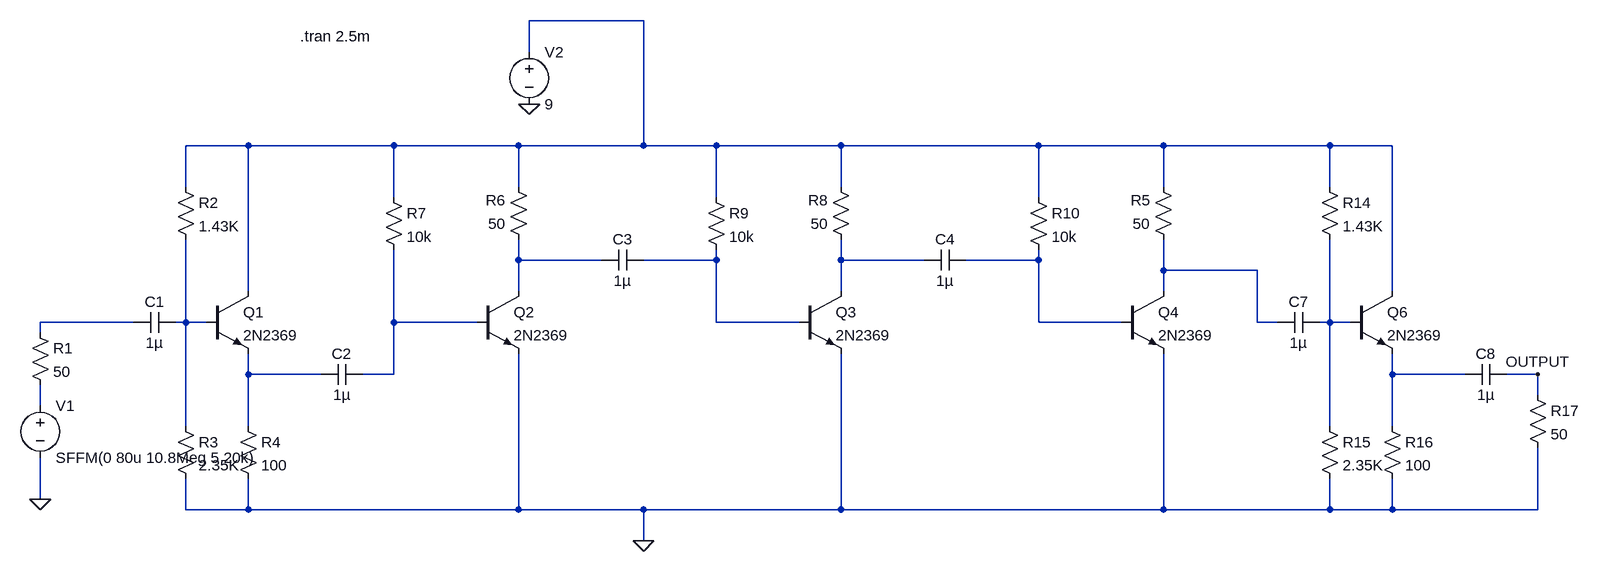
[diagram p0: schematic Multistage_Amplifier.asc]
Multistage_Amplifier.asc, the LTspice schematic file:
Version 4
SHEET 1 3060 680
WIRE 992 -192 816 -192
WIRE 816 -144 816 -192
WIRE 384 0 288 0
WIRE 608 0 384 0
WIRE 800 0 608 0
WIRE 992 0 992 -192
WIRE 992 0 800 0
WIRE 1104 0 992 0
WIRE 1296 0 1104 0
WIRE 1600 0 1296 0
WIRE 1792 0 1600 0
WIRE 2048 0 1792 0
WIRE 2144 0 2048 0
WIRE 288 64 288 0
WIRE 800 64 800 0
WIRE 1296 64 1296 0
WIRE 1792 64 1792 0
WIRE 2048 64 2048 0
WIRE 608 80 608 0
WIRE 1104 80 1104 0
WIRE 1600 80 1600 0
WIRE 800 176 800 144
WIRE 928 176 800 176
WIRE 1104 176 1104 160
WIRE 1104 176 992 176
WIRE 1296 176 1296 144
WIRE 1424 176 1296 176
WIRE 1600 176 1600 160
WIRE 1600 176 1488 176
WIRE 1792 192 1792 144
WIRE 1936 192 1792 192
WIRE 384 224 384 0
WIRE 800 224 800 176
WIRE 1296 224 1296 176
WIRE 1792 224 1792 192
WIRE 2144 224 2144 0
WIRE 208 272 64 272
WIRE 288 272 288 144
WIRE 288 272 272 272
WIRE 320 272 288 272
WIRE 608 272 608 160
WIRE 736 272 608 272
WIRE 1104 272 1104 176
WIRE 1232 272 1104 272
WIRE 1600 272 1600 176
WIRE 1728 272 1600 272
WIRE 1936 272 1936 192
WIRE 1968 272 1936 272
WIRE 2048 272 2048 144
WIRE 2048 272 2032 272
WIRE 2080 272 2048 272
WIRE 64 288 64 272
WIRE 384 352 384 320
WIRE 496 352 384 352
WIRE 608 352 608 272
WIRE 608 352 560 352
WIRE 2144 352 2144 320
WIRE 2256 352 2144 352
WIRE 2368 352 2320 352
WIRE 2368 384 2368 352
WIRE 64 400 64 368
WIRE 288 432 288 272
WIRE 384 432 384 352
WIRE 2048 432 2048 272
WIRE 2144 432 2144 352
WIRE 64 544 64 480
WIRE 288 560 288 512
WIRE 384 560 384 512
WIRE 384 560 288 560
WIRE 800 560 800 320
WIRE 800 560 384 560
WIRE 992 560 800 560
WIRE 1296 560 1296 320
WIRE 1296 560 992 560
WIRE 1792 560 1792 320
WIRE 1792 560 1296 560
WIRE 2048 560 2048 512
WIRE 2048 560 1792 560
WIRE 2144 560 2144 512
WIRE 2144 560 2048 560
WIRE 2368 560 2368 464
WIRE 2368 560 2144 560
WIRE 992 608 992 560
FLAG 64 544 0
FLAG 992 608 0
FLAG 816 -64 0
FLAG 2368 352 OUTPUT
SYMBOL npn 320 224 R0
SYMATTR InstName Q1
SYMATTR Value 2N2369
SYMBOL npn 736 224 R0
SYMATTR InstName Q2
SYMATTR Value 2N2369
SYMBOL cap 272 256 R90
WINDOW 0 0 32 VBottom 2
WINDOW 3 32 32 VTop 2
SYMATTR InstName C1
SYMATTR Value 1µ
SYMBOL res 48 272 R0
SYMATTR InstName R1
SYMATTR Value 50
SYMBOL voltage 64 384 R0
SYMATTR InstName V1
SYMATTR Value SFFM(0 80u 10.8Meg 5 20k)
SYMBOL voltage 816 -160 R0
SYMATTR InstName V2
SYMATTR Value 9
SYMATTR SpiceLine Rser=0
SYMBOL res 272 48 R0
SYMATTR InstName R2
SYMATTR Value 1.43K
SYMBOL res 272 416 R0
SYMATTR InstName R3
SYMATTR Value 2.35K
SYMBOL res 368 416 R0
SYMATTR InstName R4
SYMATTR Value 100
SYMBOL cap 560 336 R90
WINDOW 0 0 32 VBottom 2
WINDOW 3 32 32 VTop 2
SYMATTR InstName C2
SYMATTR Value 1µ
SYMBOL cap 992 160 R90
WINDOW 0 0 32 VBottom 2
WINDOW 3 32 32 VTop 2
SYMATTR InstName C3
SYMATTR Value 1µ
SYMBOL res 816 160 R180
WINDOW 0 36 76 Left 2
WINDOW 3 36 40 Left 2
SYMATTR InstName R6
SYMATTR Value 50
SYMBOL res 592 64 R0
SYMATTR InstName R7
SYMATTR Value 10k
SYMBOL npn 1232 224 R0
SYMATTR InstName Q3
SYMATTR Value 2N2369
SYMBOL res 1312 160 R180
WINDOW 0 36 76 Left 2
WINDOW 3 36 40 Left 2
SYMATTR InstName R8
SYMATTR Value 50
SYMBOL res 1088 64 R0
SYMATTR InstName R9
SYMATTR Value 10k
SYMBOL cap 1488 160 R90
WINDOW 0 0 32 VBottom 2
WINDOW 3 32 32 VTop 2
SYMATTR InstName C4
SYMATTR Value 1µ
SYMBOL npn 1728 224 R0
SYMATTR InstName Q4
SYMATTR Value 2N2369
SYMBOL res 1808 160 R180
WINDOW 0 36 76 Left 2
WINDOW 3 36 40 Left 2
SYMATTR InstName R5
SYMATTR Value 50
SYMBOL res 1584 64 R0
SYMATTR InstName R10
SYMATTR Value 10k
SYMBOL npn 2080 224 R0
SYMATTR InstName Q6
SYMATTR Value 2N2369
SYMBOL cap 2032 256 R90
WINDOW 0 0 32 VBottom 2
WINDOW 3 32 32 VTop 2
SYMATTR InstName C7
SYMATTR Value 1µ
SYMBOL res 2032 48 R0
SYMATTR InstName R14
SYMATTR Value 1.43K
SYMBOL res 2032 416 R0
SYMATTR InstName R15
SYMATTR Value 2.35K
SYMBOL res 2128 416 R0
SYMATTR InstName R16
SYMATTR Value 100
SYMBOL cap 2320 336 R90
WINDOW 0 0 32 VBottom 2
WINDOW 3 32 32 VTop 2
SYMATTR InstName C8
SYMATTR Value 1µ
SYMBOL res 2352 368 R0
SYMATTR InstName R17
SYMATTR Value 50
TEXT 464 -168 Left 2 !.tran 2.5m

The netlist it stands for:
* Multistage_Amplifier.asc
Q1 N001 N008 N011 0 2N2369
Q2 N002 N009 0 0 2N2369
C1 N008 N007 1µ
R1 N007 N013 50
V1 N013 0 SFFM(0 80u 10.8Meg 5 20k)
V2 N001 0 9 Rser=0
R2 N001 N008 1.43K
R3 N008 0 2.35K
R4 N011 0 100
C2 N009 N011 1µ
C3 N003 N002 1µ
R6 N002 N001 50
R7 N001 N009 10k
Q3 N004 N003 0 0 2N2369
R8 N004 N001 50
R9 N001 N003 10k
C4 N005 N004 1µ
Q4 N006 N005 0 0 2N2369
R5 N006 N001 50
R10 N001 N005 10k
Q6 N001 N010 N012 0 2N2369
C7 N010 N006 1µ
R14 N001 N010 1.43K
R15 N010 0 2.35K
R16 N012 0 100
C8 OUTPUT N012 1µ
R17 OUTPUT 0 50
.model NPN NPN
.model PNP PNP
.lib standard.bjt
.tran 2.5m
.backanno
.end